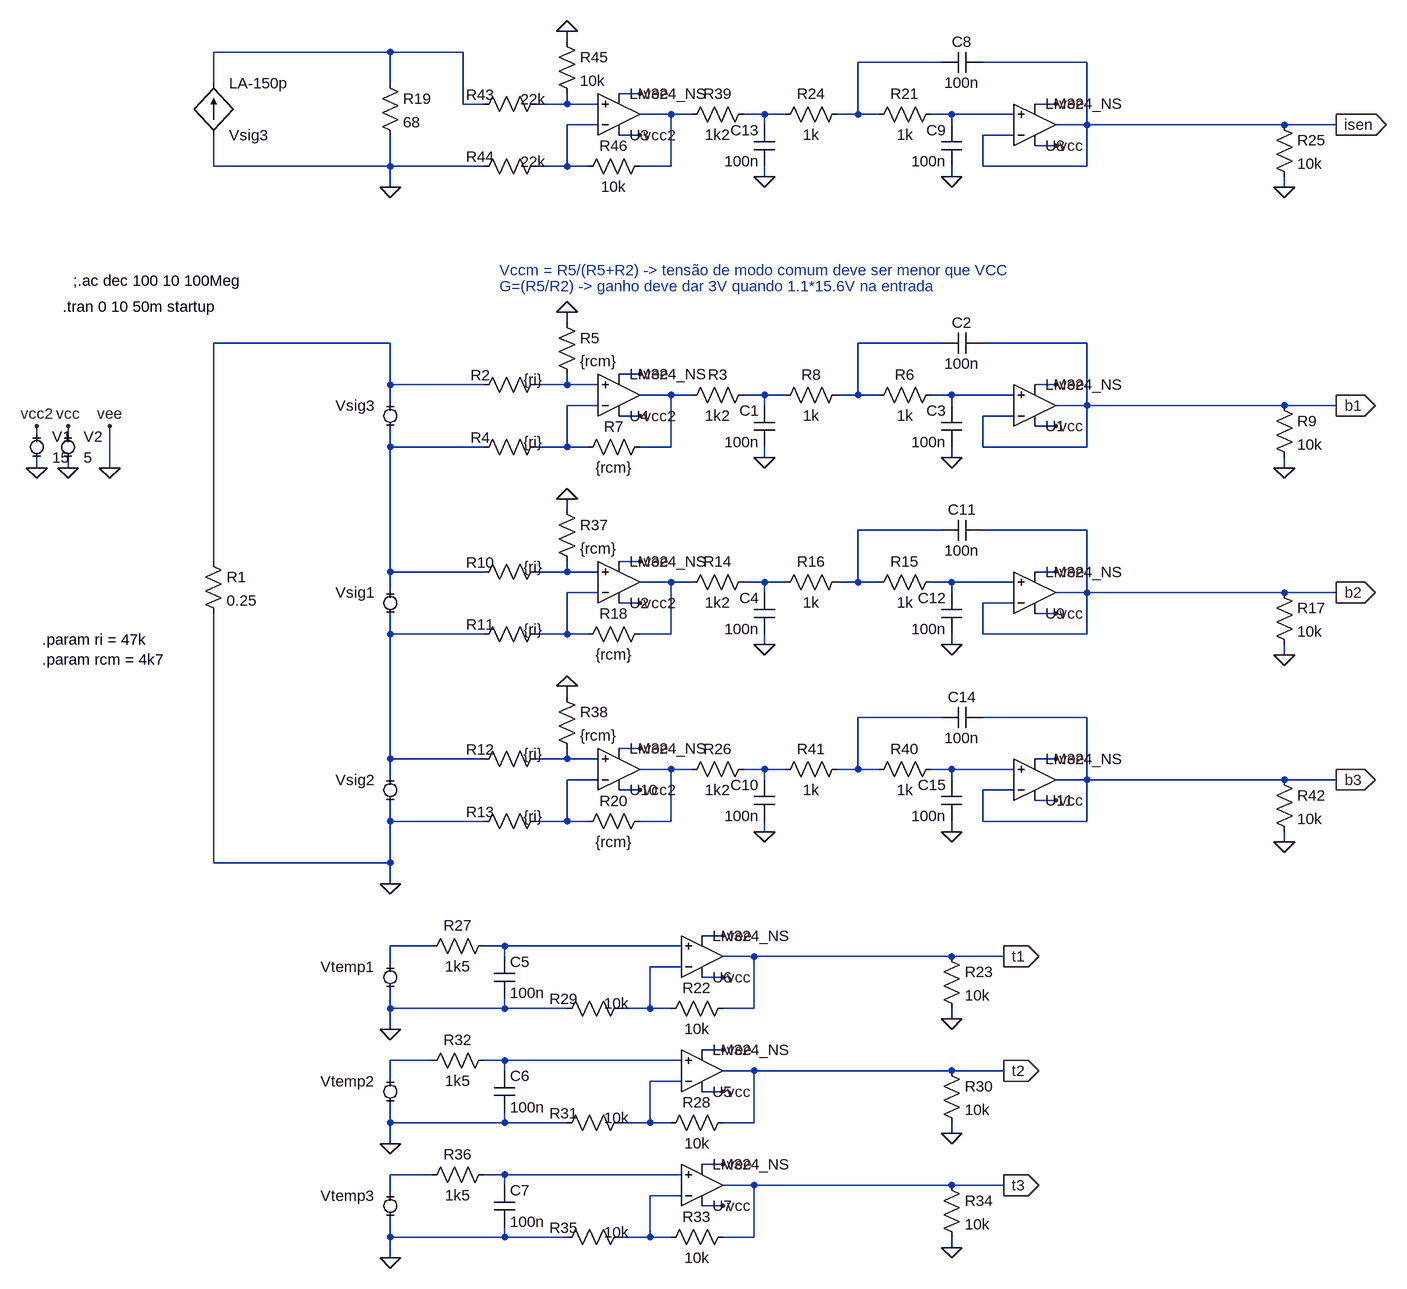
[diagram p0: schematic diff+sallenkey.asc]
diff+sallenkey.asc, the LTspice schematic file:
Version 4
SHEET 1 1744 1492
WIRE -464 -480 -464 -496
WIRE -736 -464 -1008 -464
WIRE -624 -464 -736 -464
WIRE 112 -448 -16 -448
WIRE 336 -448 176 -448
WIRE -1008 -416 -1008 -464
WIRE -736 -416 -736 -464
WIRE -352 -400 -384 -400
WIRE -624 -384 -624 -464
WIRE -592 -384 -624 -384
WIRE -464 -384 -464 -400
WIRE -464 -384 -512 -384
WIRE -416 -384 -464 -384
WIRE 288 -384 256 -384
WIRE -304 -368 -352 -368
WIRE -272 -368 -304 -368
WIRE -160 -368 -192 -368
WIRE -128 -368 -160 -368
WIRE -16 -368 -16 -448
WIRE -16 -368 -48 -368
WIRE 16 -368 -16 -368
WIRE 128 -368 96 -368
WIRE 224 -368 128 -368
WIRE -416 -352 -464 -352
WIRE -160 -352 -160 -368
WIRE 128 -352 128 -368
WIRE 336 -352 336 -448
WIRE 336 -352 288 -352
WIRE 640 -352 336 -352
WIRE 720 -352 640 -352
WIRE -352 -336 -384 -336
WIRE 224 -336 176 -336
WIRE 288 -320 256 -320
WIRE -1008 -288 -1008 -336
WIRE -736 -288 -736 -336
WIRE -736 -288 -1008 -288
WIRE -592 -288 -736 -288
WIRE -464 -288 -464 -352
WIRE -464 -288 -512 -288
WIRE -432 -288 -464 -288
WIRE -304 -288 -304 -368
WIRE -304 -288 -352 -288
WIRE 176 -288 176 -336
WIRE 336 -288 336 -352
WIRE 336 -288 176 -288
WIRE -160 -272 -160 -288
WIRE 128 -272 128 -288
WIRE -736 -256 -736 -288
WIRE 640 -256 640 -272
WIRE -464 -48 -464 -64
WIRE -736 -16 -1008 -16
WIRE 112 -16 -16 -16
WIRE 336 -16 176 -16
WIRE -352 32 -384 32
WIRE -736 48 -736 -16
WIRE -592 48 -736 48
WIRE -464 48 -464 32
WIRE -464 48 -512 48
WIRE -416 48 -464 48
WIRE 288 48 256 48
WIRE -304 64 -352 64
WIRE -272 64 -304 64
WIRE -160 64 -192 64
WIRE -128 64 -160 64
WIRE -16 64 -16 -16
WIRE -16 64 -48 64
WIRE 16 64 -16 64
WIRE 128 64 96 64
WIRE 224 64 128 64
WIRE -736 80 -736 48
WIRE -416 80 -464 80
WIRE -160 80 -160 64
WIRE 128 80 128 64
WIRE 336 80 336 -16
WIRE 336 80 288 80
WIRE 640 80 336 80
WIRE 720 80 640 80
WIRE -352 96 -384 96
WIRE 224 96 176 96
WIRE 288 112 256 112
WIRE -1280 128 -1280 112
WIRE -1232 128 -1232 112
WIRE -736 144 -736 112
WIRE -592 144 -736 144
WIRE -464 144 -464 80
WIRE -464 144 -512 144
WIRE -432 144 -464 144
WIRE -304 144 -304 64
WIRE -304 144 -352 144
WIRE 176 144 176 96
WIRE 336 144 336 80
WIRE 336 144 176 144
WIRE -160 160 -160 144
WIRE 128 160 128 144
WIRE -1280 176 -1280 160
WIRE -1232 176 -1232 160
WIRE -1168 176 -1168 112
WIRE 640 176 640 160
WIRE -464 240 -464 224
WIRE 112 272 -16 272
WIRE 336 272 176 272
WIRE -1008 320 -1008 -16
WIRE -352 320 -384 320
WIRE -736 336 -736 144
WIRE -592 336 -736 336
WIRE -464 336 -464 320
WIRE -464 336 -512 336
WIRE -416 336 -464 336
WIRE 288 336 256 336
WIRE -304 352 -352 352
WIRE -272 352 -304 352
WIRE -160 352 -192 352
WIRE -128 352 -160 352
WIRE -16 352 -16 272
WIRE -16 352 -48 352
WIRE 16 352 -16 352
WIRE 128 352 96 352
WIRE 224 352 128 352
WIRE -736 368 -736 336
WIRE -416 368 -464 368
WIRE -160 368 -160 352
WIRE 128 368 128 352
WIRE 336 368 336 272
WIRE 336 368 288 368
WIRE 640 368 336 368
WIRE 720 368 640 368
WIRE -352 384 -384 384
WIRE 224 384 176 384
WIRE 288 400 256 400
WIRE -736 432 -736 400
WIRE -592 432 -736 432
WIRE -464 432 -464 368
WIRE -464 432 -512 432
WIRE -432 432 -464 432
WIRE -304 432 -304 352
WIRE -304 432 -352 432
WIRE 176 432 176 384
WIRE 336 432 336 368
WIRE 336 432 176 432
WIRE -160 448 -160 432
WIRE 128 448 128 432
WIRE 640 464 640 448
WIRE -464 528 -464 512
WIRE 112 560 -16 560
WIRE 336 560 176 560
WIRE -352 608 -384 608
WIRE -736 624 -736 432
WIRE -592 624 -736 624
WIRE -464 624 -464 608
WIRE -464 624 -512 624
WIRE -416 624 -464 624
WIRE 288 624 256 624
WIRE -304 640 -352 640
WIRE -272 640 -304 640
WIRE -160 640 -192 640
WIRE -128 640 -160 640
WIRE -16 640 -16 560
WIRE -16 640 -48 640
WIRE 16 640 -16 640
WIRE 128 640 96 640
WIRE 224 640 128 640
WIRE -736 656 -736 624
WIRE -416 656 -464 656
WIRE -160 656 -160 640
WIRE 128 656 128 640
WIRE 336 656 336 560
WIRE 336 656 288 656
WIRE 640 656 336 656
WIRE 720 656 640 656
WIRE -352 672 -384 672
WIRE 224 672 176 672
WIRE 288 688 256 688
WIRE -736 720 -736 688
WIRE -592 720 -736 720
WIRE -464 720 -464 656
WIRE -464 720 -512 720
WIRE -432 720 -464 720
WIRE -304 720 -304 640
WIRE -304 720 -352 720
WIRE 176 720 176 672
WIRE 336 720 336 656
WIRE 336 720 176 720
WIRE -160 736 -160 720
WIRE 128 736 128 720
WIRE 640 752 640 736
WIRE -1008 784 -1008 400
WIRE -736 784 -736 720
WIRE -736 784 -1008 784
WIRE -736 816 -736 784
WIRE -224 896 -256 896
WIRE -672 912 -736 912
WIRE -560 912 -592 912
WIRE -288 912 -560 912
WIRE -560 928 -560 912
WIRE -176 928 -224 928
WIRE 128 928 -176 928
WIRE 208 928 128 928
WIRE -736 944 -736 912
WIRE -288 944 -336 944
WIRE -224 960 -256 960
WIRE -736 1008 -736 976
WIRE -560 1008 -560 992
WIRE -560 1008 -736 1008
WIRE -464 1008 -560 1008
WIRE -336 1008 -336 944
WIRE -336 1008 -384 1008
WIRE -304 1008 -336 1008
WIRE -176 1008 -176 928
WIRE -176 1008 -224 1008
WIRE 128 1024 128 1008
WIRE -736 1040 -736 1008
WIRE -224 1072 -256 1072
WIRE -672 1088 -736 1088
WIRE -560 1088 -592 1088
WIRE -288 1088 -560 1088
WIRE -560 1104 -560 1088
WIRE -176 1104 -224 1104
WIRE 128 1104 -176 1104
WIRE 208 1104 128 1104
WIRE -736 1120 -736 1088
WIRE -288 1120 -336 1120
WIRE -224 1136 -256 1136
WIRE -736 1184 -736 1152
WIRE -560 1184 -560 1168
WIRE -560 1184 -736 1184
WIRE -464 1184 -560 1184
WIRE -336 1184 -336 1120
WIRE -336 1184 -384 1184
WIRE -304 1184 -336 1184
WIRE -176 1184 -176 1104
WIRE -176 1184 -224 1184
WIRE 128 1200 128 1184
WIRE -736 1216 -736 1184
WIRE -224 1248 -256 1248
WIRE -672 1264 -736 1264
WIRE -560 1264 -592 1264
WIRE -288 1264 -560 1264
WIRE -560 1280 -560 1264
WIRE -176 1280 -224 1280
WIRE 128 1280 -176 1280
WIRE 208 1280 128 1280
WIRE -736 1296 -736 1264
WIRE -288 1296 -336 1296
WIRE -224 1312 -256 1312
WIRE -736 1360 -736 1328
WIRE -560 1360 -560 1344
WIRE -560 1360 -736 1360
WIRE -464 1360 -560 1360
WIRE -336 1360 -336 1296
WIRE -336 1360 -384 1360
WIRE -304 1360 -336 1360
WIRE -176 1360 -176 1280
WIRE -176 1360 -224 1360
WIRE 128 1376 128 1360
WIRE -736 1392 -736 1360
FLAG -1232 176 0
FLAG -1232 112 vcc
FLAG -352 96 vcc2
FLAG -736 816 0
FLAG 720 80 b1
IOPIN 720 80 Out
FLAG -1168 176 0
FLAG -1168 112 vee
FLAG -352 32 vee
FLAG -464 -64 0
FLAG -736 -256 0
FLAG 720 -352 isen
IOPIN 720 -352 Out
FLAG 640 -256 0
FLAG -736 1040 0
FLAG 208 1104 t2
IOPIN 208 1104 Out
FLAG 128 1200 0
FLAG -736 1216 0
FLAG 208 1280 t3
IOPIN 208 1280 Out
FLAG 128 1376 0
FLAG -736 1392 0
FLAG 288 -320 vcc
FLAG 288 -384 vee
FLAG 128 -272 0
FLAG 288 112 vcc
FLAG 288 48 vee
FLAG 128 160 0
FLAG 640 176 0
FLAG -352 384 vcc2
FLAG 720 368 b2
IOPIN 720 368 Out
FLAG -352 320 vee
FLAG -464 224 0
FLAG 288 400 vcc
FLAG 288 336 vee
FLAG 128 448 0
FLAG 640 464 0
FLAG -352 672 vcc2
FLAG 720 656 b3
IOPIN 720 656 Out
FLAG -352 608 vee
FLAG -464 512 0
FLAG 288 688 vcc
FLAG 288 624 vee
FLAG 128 736 0
FLAG 640 752 0
FLAG -224 960 vcc
FLAG 208 928 t1
IOPIN 208 928 Out
FLAG -224 896 vee
FLAG 128 1024 0
FLAG -1280 176 0
FLAG -1280 112 vcc2
FLAG -160 160 0
FLAG -160 448 0
FLAG -160 736 0
FLAG -160 -272 0
FLAG -224 1136 vcc
FLAG -224 1072 vee
FLAG -224 1312 vcc
FLAG -224 1248 vee
FLAG -352 -336 vcc2
FLAG -352 -400 vee
FLAG -464 -496 0
SYMBOL MiniSyms4\\voltage- -1232 144 R0
WINDOW 123 0 0 Left 0
WINDOW 39 0 0 Left 0
SYMATTR InstName V2
SYMATTR Value 5
SYMBOL MiniSyms4\\voltage- -736 384 M0
WINDOW 3 11 11 Invisible 0
WINDOW 39 0 0 Left 0
SYMATTR Value SINE(8.58 8.58 12)
SYMATTR Value2 AC 1.
SYMATTR InstName Vsig1
SYMBOL MiniSyms4\\voltage- -736 672 M0
WINDOW 3 11 11 Invisible 0
WINDOW 39 0 0 Left 0
SYMATTR Value SINE(8.58 8.58 13)
SYMATTR Value2 AC 1.
SYMATTR InstName Vsig2
SYMBOL res -1024 304 R0
SYMATTR InstName R1
SYMATTR Value 0.25
SYMBOL res -496 32 R90
WINDOW 0 17 101 VBottom 2
WINDOW 3 -7 20 VTop 2
SYMATTR InstName R2
SYMATTR Value {ri}
SYMBOL MiniSyms4\\voltage- -736 96 M0
WINDOW 39 0 0 Left 2
WINDOW 3 11 11 Invisible 0
SYMATTR Value SINE(8.58 8.58 11)
SYMATTR Value2 AC 1.
SYMATTR InstName Vsig3
SYMBOL res -480 -64 R0
SYMATTR InstName R5
SYMATTR Value {rcm}
SYMBOL EXTRA\\ExtraOpamps\\LM324_NS -384 64 M180
SYMATTR InstName U4
SYMBOL f -1008 -336 M180
WINDOW 0 24 80 Left 2
WINDOW 3 24 0 Left 2
SYMATTR InstName LA-150p
SYMATTR Value Vsig3
SYMATTR Value2 -0.0005
SYMBOL res -752 -432 R0
SYMATTR InstName R19
SYMATTR Value 68
SYMBOL res 624 -368 R0
SYMATTR InstName R25
SYMATTR Value 10k
SYMBOL MiniSyms4\\voltage- -736 960 M0
WINDOW 39 7 17 Left 0
WINDOW 3 11 11 Invisible 0
SYMATTR Value SINE(0.75 0.75 20)
SYMATTR Value2 AC 1.
SYMATTR InstName Vtemp1
SYMBOL res 112 1088 R0
SYMATTR InstName R30
SYMATTR Value 10k
SYMBOL MiniSyms4\\voltage- -736 1136 M0
WINDOW 39 7 17 Left 0
WINDOW 3 11 11 Invisible 0
SYMATTR Value SINE(0.75 0.75 21)
SYMATTR Value2 AC 1.
SYMATTR InstName Vtemp2
SYMBOL res 112 1264 R0
SYMATTR InstName R34
SYMATTR Value 10k
SYMBOL MiniSyms4\\voltage- -736 1312 M0
WINDOW 39 7 17 Left 0
WINDOW 3 11 11 Invisible 0
SYMATTR Value SINE(0.75 0.75 22)
SYMATTR Value2 AC 1.
SYMATTR InstName Vtemp3
SYMBOL EXTRA\\ExtraOpamps\\LM324_NS 256 -352 M180
SYMATTR InstName U8
SYMBOL cap 176 -464 R90
WINDOW 0 0 32 VBottom 2
WINDOW 3 32 32 VTop 2
SYMATTR InstName C8
SYMATTR Value 100n
SYMBOL cap 144 -352 M0
SYMATTR InstName C9
SYMATTR Value 100n
SYMBOL res 112 -384 R90
WINDOW 0 0 56 VBottom 2
WINDOW 3 32 56 VTop 2
SYMATTR InstName R21
SYMATTR Value 1k
SYMBOL res -32 -384 R90
WINDOW 0 0 56 VBottom 2
WINDOW 3 32 56 VTop 2
SYMATTR InstName R24
SYMATTR Value 1k
SYMBOL EXTRA\\ExtraOpamps\\LM324_NS 256 80 M180
SYMATTR InstName U1
SYMBOL cap 176 -32 R90
WINDOW 0 0 32 VBottom 2
WINDOW 3 32 32 VTop 2
SYMATTR InstName C2
SYMATTR Value 100n
SYMBOL cap 144 80 M0
SYMATTR InstName C3
SYMATTR Value 100n
SYMBOL res 112 48 R90
WINDOW 0 0 56 VBottom 2
WINDOW 3 32 56 VTop 2
SYMATTR InstName R6
SYMATTR Value 1k
SYMBOL res -32 48 R90
WINDOW 0 0 56 VBottom 2
WINDOW 3 32 56 VTop 2
SYMATTR InstName R8
SYMATTR Value 1k
SYMBOL res 624 64 R0
SYMATTR InstName R9
SYMATTR Value 10k
SYMBOL EXTRA\\ExtraOpamps\\LM324_NS -384 352 M180
SYMATTR InstName U2
SYMBOL EXTRA\\ExtraOpamps\\LM324_NS 256 368 M180
SYMATTR InstName U9
SYMBOL cap 176 256 R90
WINDOW 0 0 32 VBottom 2
WINDOW 3 32 32 VTop 2
SYMATTR InstName C11
SYMATTR Value 100n
SYMBOL cap 144 368 M0
SYMATTR InstName C12
SYMATTR Value 100n
SYMBOL res 112 336 R90
WINDOW 0 0 56 VBottom 2
WINDOW 3 32 56 VTop 2
SYMATTR InstName R15
SYMATTR Value 1k
SYMBOL res -32 336 R90
WINDOW 0 0 56 VBottom 2
WINDOW 3 32 56 VTop 2
SYMATTR InstName R16
SYMATTR Value 1k
SYMBOL res 624 352 R0
SYMATTR InstName R17
SYMATTR Value 10k
SYMBOL EXTRA\\ExtraOpamps\\LM324_NS -384 640 M180
SYMATTR InstName U10
SYMBOL EXTRA\\ExtraOpamps\\LM324_NS 256 656 M180
SYMATTR InstName U11
SYMBOL cap 176 544 R90
WINDOW 0 0 32 VBottom 2
WINDOW 3 32 32 VTop 2
SYMATTR InstName C14
SYMATTR Value 100n
SYMBOL cap 144 656 M0
SYMATTR InstName C15
SYMATTR Value 100n
SYMBOL res 112 624 R90
WINDOW 0 0 56 VBottom 2
WINDOW 3 32 56 VTop 2
SYMATTR InstName R40
SYMATTR Value 1k
SYMBOL res -32 624 R90
WINDOW 0 0 56 VBottom 2
WINDOW 3 32 56 VTop 2
SYMATTR InstName R41
SYMATTR Value 1k
SYMBOL res 624 640 R0
SYMATTR InstName R42
SYMATTR Value 10k
SYMBOL res -208 992 R90
WINDOW 0 0 56 VBottom 2
WINDOW 3 32 56 VTop 2
SYMATTR InstName R22
SYMATTR Value 10k
SYMBOL EXTRA\\ExtraOpamps\\LM324_NS -256 928 M180
SYMATTR InstName U6
SYMBOL res 112 912 R0
SYMATTR InstName R23
SYMATTR Value 10k
SYMBOL res -368 992 R90
WINDOW 0 17 101 VBottom 2
WINDOW 3 -7 20 VTop 2
SYMATTR InstName R29
SYMATTR Value 10k
SYMBOL MiniSyms4\\voltage- -1280 144 R0
WINDOW 123 0 0 Left 0
WINDOW 39 0 0 Left 0
SYMATTR InstName V1
SYMATTR Value 15
SYMBOL cap -144 80 M0
SYMATTR InstName C1
SYMATTR Value 100n
SYMBOL res -176 48 R90
WINDOW 0 0 56 VBottom 2
WINDOW 3 32 56 VTop 2
SYMATTR InstName R3
SYMATTR Value 1k2
SYMBOL cap -144 368 M0
SYMATTR InstName C4
SYMATTR Value 100n
SYMBOL res -176 336 R90
WINDOW 0 0 56 VBottom 2
WINDOW 3 32 56 VTop 2
SYMATTR InstName R14
SYMATTR Value 1k2
SYMBOL cap -144 656 M0
SYMATTR InstName C10
SYMATTR Value 100n
SYMBOL res -176 624 R90
WINDOW 0 0 56 VBottom 2
WINDOW 3 32 56 VTop 2
SYMATTR InstName R26
SYMATTR Value 1k2
SYMBOL cap -144 -352 M0
SYMATTR InstName C13
SYMATTR Value 100n
SYMBOL res -176 -384 R90
WINDOW 0 0 56 VBottom 2
WINDOW 3 32 56 VTop 2
SYMATTR InstName R39
SYMATTR Value 1k2
SYMBOL cap -576 928 R0
SYMATTR InstName C5
SYMATTR Value 100n
SYMBOL res -576 896 R90
WINDOW 0 0 56 VBottom 2
WINDOW 3 32 56 VTop 2
SYMATTR InstName R27
SYMATTR Value 1k5
SYMBOL res -208 1168 R90
WINDOW 0 0 56 VBottom 2
WINDOW 3 32 56 VTop 2
SYMATTR InstName R28
SYMATTR Value 10k
SYMBOL EXTRA\\ExtraOpamps\\LM324_NS -256 1104 M180
SYMATTR InstName U5
SYMBOL res -368 1168 R90
WINDOW 0 17 101 VBottom 2
WINDOW 3 -7 20 VTop 2
SYMATTR InstName R31
SYMATTR Value 10k
SYMBOL cap -576 1104 R0
SYMATTR InstName C6
SYMATTR Value 100n
SYMBOL res -576 1072 R90
WINDOW 0 0 56 VBottom 2
WINDOW 3 32 56 VTop 2
SYMATTR InstName R32
SYMATTR Value 1k5
SYMBOL res -208 1344 R90
WINDOW 0 0 56 VBottom 2
WINDOW 3 32 56 VTop 2
SYMATTR InstName R33
SYMATTR Value 10k
SYMBOL EXTRA\\ExtraOpamps\\LM324_NS -256 1280 M180
SYMATTR InstName U7
SYMBOL res -368 1344 R90
WINDOW 0 17 101 VBottom 2
WINDOW 3 -7 20 VTop 2
SYMATTR InstName R35
SYMATTR Value 10k
SYMBOL cap -576 1280 R0
SYMATTR InstName C7
SYMATTR Value 100n
SYMBOL res -576 1248 R90
WINDOW 0 0 56 VBottom 2
WINDOW 3 32 56 VTop 2
SYMATTR InstName R36
SYMATTR Value 1k5
SYMBOL res -496 -400 R90
WINDOW 0 17 101 VBottom 2
WINDOW 3 -7 20 VTop 2
SYMATTR InstName R43
SYMATTR Value 22k
SYMBOL res -496 -304 R90
WINDOW 0 17 101 VBottom 2
WINDOW 3 -7 20 VTop 2
SYMATTR InstName R44
SYMATTR Value 22k
SYMBOL res -480 -496 R0
SYMATTR InstName R45
SYMATTR Value 10k
SYMBOL res -336 -304 R90
WINDOW 0 0 56 VBottom 2
WINDOW 3 32 56 VTop 2
SYMATTR InstName R46
SYMATTR Value 10k
SYMBOL EXTRA\\ExtraOpamps\\LM324_NS -384 -368 M180
SYMATTR InstName U3
SYMBOL res -496 128 R90
WINDOW 0 17 101 VBottom 2
WINDOW 3 -7 20 VTop 2
SYMATTR InstName R4
SYMATTR Value {ri}
SYMBOL res -336 128 R90
WINDOW 0 0 56 VBottom 2
WINDOW 3 32 56 VTop 2
SYMATTR InstName R7
SYMATTR Value {rcm}
SYMBOL res -496 320 R90
WINDOW 0 17 101 VBottom 2
WINDOW 3 -7 20 VTop 2
SYMATTR InstName R10
SYMATTR Value {ri}
SYMBOL res -496 416 R90
WINDOW 0 17 101 VBottom 2
WINDOW 3 -7 20 VTop 2
SYMATTR InstName R11
SYMATTR Value {ri}
SYMBOL res -496 608 R90
WINDOW 0 17 101 VBottom 2
WINDOW 3 -7 20 VTop 2
SYMATTR InstName R12
SYMATTR Value {ri}
SYMBOL res -496 704 R90
WINDOW 0 17 101 VBottom 2
WINDOW 3 -7 20 VTop 2
SYMATTR InstName R13
SYMATTR Value {ri}
SYMBOL res -336 416 R90
WINDOW 0 0 56 VBottom 2
WINDOW 3 32 56 VTop 2
SYMATTR InstName R18
SYMATTR Value {rcm}
SYMBOL res -336 704 R90
WINDOW 0 0 56 VBottom 2
WINDOW 3 32 56 VTop 2
SYMATTR InstName R20
SYMATTR Value {rcm}
SYMBOL res -480 224 R0
SYMATTR InstName R37
SYMATTR Value {rcm}
SYMBOL res -480 512 R0
SYMATTR InstName R38
SYMATTR Value {rcm}
TEXT -1240 -72 Left 2 !.tran 0 10 50m startup
TEXT -1224 -112 Left 2 !;.ac dec 100 10 100Meg
TEXT -568 -128 Left 2 ;Vccm = R5/(R5+R2) -> tensão de modo comum deve ser menor que VCC
TEXT -568 -104 Left 2 ;G=(R5/R2) -> ganho deve dar 3V quando 1.1*15.6V na entrada
TEXT -1272 440 Left 2 !.param ri = 47k\n.param rcm = 4k7

The netlist it stands for:
* diff+sallenkey.asc
V2 vcc 0 5
Vsig1 N015 N022 SINE(8.58 8.58 12) AC 1.
Vsig2 N022 0 SINE(8.58 8.58 13) AC 1.
R1 N008 0 0.25
R2 N010 N008 {ri}
Vsig3 N008 N015 SINE(8.58 8.58 11) AC 1.
R5 0 N010 {rcm}
* U4: LM324_NS (symbol EXTRA\ExtraOpamps\LM324_NS not available, pins judged from their places): In+=N010 In-=N014 V+=vcc2 V-=0 OUT=N011
F§LA-150p 0 N001 Vsig3 -0.0005
R19 N001 0 68
R25 isen 0 10k
Vtemp1 N029 0 SINE(0.75 0.75 20) AC 1.
R30 t2 0 10k
Vtemp2 N032 0 SINE(0.75 0.75 21) AC 1.
R34 t3 0 10k
Vtemp3 N035 0 SINE(0.75 0.75 22) AC 1.
* U8: LM324_NS (symbol EXTRA\ExtraOpamps\LM324_NS not available, pins judged from their places): In+=N006 In-=isen V+=vcc V-=0 OUT=isen
C8 isen N002 100n
C9 N006 0 100n
R21 N006 N002 1k
R24 N002 N005 1k
* U1: LM324_NS (symbol EXTRA\ExtraOpamps\LM324_NS not available, pins judged from their places): In+=N013 In-=b1 V+=vcc V-=0 OUT=b1
C2 b1 N009 100n
C3 N013 0 100n
R6 N013 N009 1k
R8 N009 N012 1k
R9 b1 0 10k
* U2: LM324_NS (symbol EXTRA\ExtraOpamps\LM324_NS not available, pins judged from their places): In+=N017 In-=N021 V+=vcc2 V-=0 OUT=N018
* U9: LM324_NS (symbol EXTRA\ExtraOpamps\LM324_NS not available, pins judged from their places): In+=N020 In-=b2 V+=vcc V-=0 OUT=b2
C11 b2 N016 100n
C12 N020 0 100n
R15 N020 N016 1k
R16 N016 N019 1k
R17 b2 0 10k
* U10: LM324_NS (symbol EXTRA\ExtraOpamps\LM324_NS not available, pins judged from their places): In+=N024 In-=N028 V+=vcc2 V-=0 OUT=N025
* U11: LM324_NS (symbol EXTRA\ExtraOpamps\LM324_NS not available, pins judged from their places): In+=N027 In-=b3 V+=vcc V-=0 OUT=b3
C14 b3 N023 100n
C15 N027 0 100n
R40 N027 N023 1k
R41 N023 N026 1k
R42 b3 0 10k
R22 t1 N031 10k
* U6: LM324_NS (symbol EXTRA\ExtraOpamps\LM324_NS not available, pins judged from their places): In+=N030 In-=N031 V+=vcc V-=0 OUT=t1
R23 t1 0 10k
R29 N031 0 10k
V1 vcc2 0 15
C1 N012 0 100n
R3 N012 N011 1k2
C4 N019 0 100n
R14 N019 N018 1k2
C10 N026 0 100n
R26 N026 N025 1k2
C13 N005 0 100n
R39 N005 N004 1k2
C5 N030 0 100n
R27 N030 N029 1k5
R28 t2 N034 10k
* U5: LM324_NS (symbol EXTRA\ExtraOpamps\LM324_NS not available, pins judged from their places): In+=N033 In-=N034 V+=vcc V-=0 OUT=t2
R31 N034 0 10k
C6 N033 0 100n
R32 N033 N032 1k5
R33 t3 N037 10k
* U7: LM324_NS (symbol EXTRA\ExtraOpamps\LM324_NS not available, pins judged from their places): In+=N036 In-=N037 V+=vcc V-=0 OUT=t3
R35 N037 0 10k
C7 N036 0 100n
R36 N036 N035 1k5
R43 N003 N001 22k
R44 N007 0 22k
R45 0 N003 10k
R46 N004 N007 10k
* U3: LM324_NS (symbol EXTRA\ExtraOpamps\LM324_NS not available, pins judged from their places): In+=N003 In-=N007 V+=vcc2 V-=0 OUT=N004
R4 N014 N015 {ri}
R7 N011 N014 {rcm}
R10 N017 N015 {ri}
R11 N021 N022 {ri}
R12 N024 N022 {ri}
R13 N028 0 {ri}
R18 N018 N021 {rcm}
R20 N025 N028 {rcm}
R37 0 N017 {rcm}
R38 0 N024 {rcm}
.tran 0 10 50m startup
;.ac dec 100 10 100Meg
* Vccm = R5/(R5+R2) -> tensão de modo comum deve ser menor que VCC
* G=(R5/R2) -> ganho deve dar 3V quando 1.1*15.6V na entrada
.param ri = 47k
.param rcm = 4k7
.backanno
.end